# EAGLE schematic untitled (EAGLE 7.7.0)
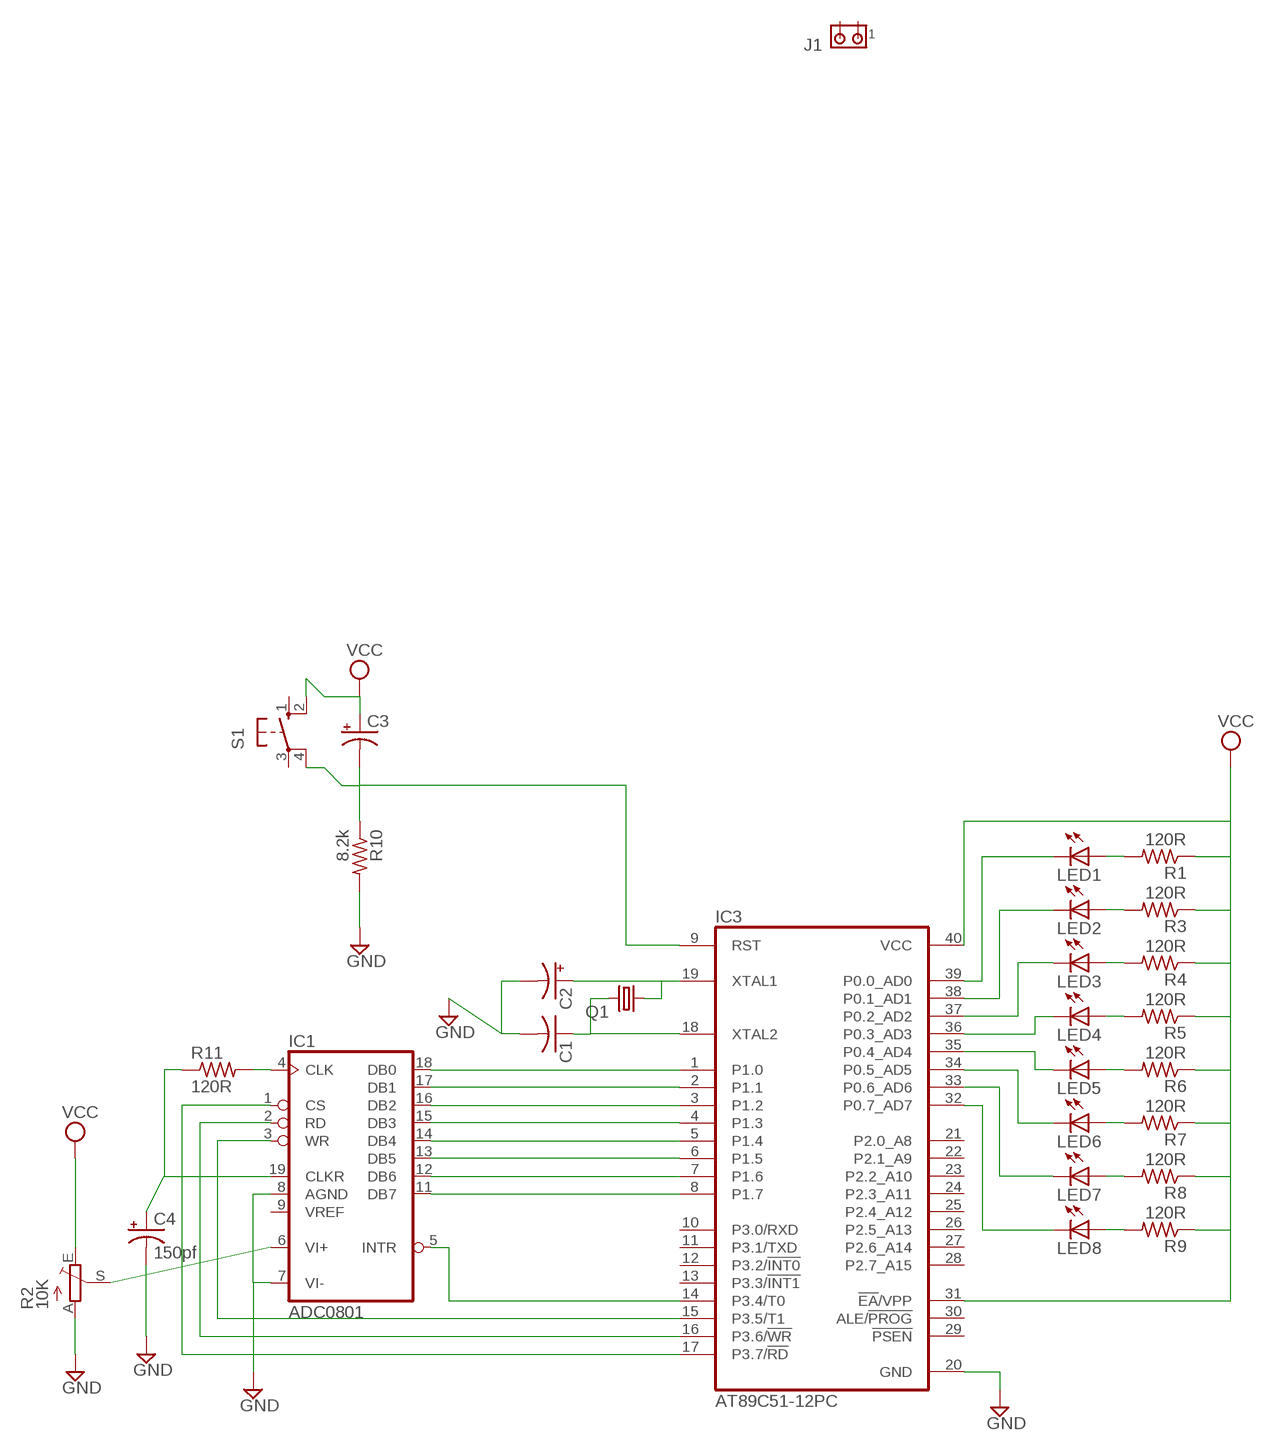
[diagram p0: schematic, sheet 1]

## Parts
C1  C-US025-025X050  [C025-025X050]
C2  CPOL-USE2.5-5V  [E2,5-4R]
C3  CPOL-USE2.5-5V  [E2,5-4R]
C4  150pf  CPOL-USE2.5-5V  [E2,5-4R]
IC1  ADC0801  [DIL20]
IC3  AT89C51-12PC  [DIL40]
J1  MTA02-100  [10X02MTA]
LED1  LEDCHIP-LED0805  [CHIP-LED0805]
LED2  LEDCHIP-LED0805  [CHIP-LED0805]
LED3  LEDCHIP-LED0805  [CHIP-LED0805]
LED4  LEDCHIP-LED0805  [CHIP-LED0805]
LED5  LEDCHIP-LED0805  [CHIP-LED0805]
LED6  LEDCHIP-LED0805  [CHIP-LED0805]
LED7  LEDCHIP-LED0805  [CHIP-LED0805]
LED8  LEDCHIP-LED0805  [CHIP-LED0805]
Q1  CRYSTALTC26H  [TC26H]
R1  120R  R-US_R2512  [R2512]
R2  10K  TRIM_EU-B25U  [B25U]
R3  120R  R-US_R2512  [R2512]
R4  120R  R-US_R2512  [R2512]
R5  120R  R-US_R2512  [R2512]
R6  120R  R-US_R2512  [R2512]
R7  120R  R-US_R2512  [R2512]
R8  120R  R-US_R2512  [R2512]
R9  120R  R-US_R2512  [R2512]
R10  8.2k  R-US_R2512  [R2512]
R11  120R  R-US_R2512  [R2512]
S1  10-XX  [B3F-10XX]

## Nets
GND: C1.2 C2.- C4.- IC1.7(VI-) IC1.8(AGND) IC3.20(GND) R2.A R10.2
N$1: IC3.39(P0.0_AD0) LED1.C
N$2: IC3.32(P0.7_AD7) LED8.C
N$3: IC3.33(P0.6_AD6) LED7.C
N$4: IC3.38(P0.1_AD1) LED2.C
N$5: IC3.37(P0.2_AD2) LED3.C
N$6: IC3.34(P0.5_AD5) LED6.C
N$7: IC3.35(P0.4_AD4) LED5.C
N$8: IC3.36(P0.3_AD3) LED4.C
N$9: LED8.A R9.2
N$10: LED7.A R8.2
N$11: LED6.A R7.2
N$12: LED5.A R6.2
N$13: LED4.A R5.2
N$14: LED3.A R4.2
N$15: LED2.A R3.2
N$16: LED1.A R1.2
N$17: C2.+ IC3.19(XTAL1) Q1.1
N$18: C1.1 IC3.18(XTAL2) Q1.2
N$20: IC1.12(DB6) IC3.7(P1.6)
N$21: C3.- IC3.9(RST) R10.1 S1.4(P1)
N$22: IC1.13(DB5) IC3.6(P1.5)
N$23: IC1.14(DB4) IC3.5(P1.4)
N$24: IC1.15(DB3) IC3.4(P1.3)
N$25: IC1.16(DB2) IC3.3(P1.2)
N$26: IC1.17(DB1) IC3.2(P1.1)
N$27: IC1.11(DB7) IC3.8(P1.7)
N$28: IC1.18(DB0) IC3.1(P1.0)
N$29: IC1.5(INTR) IC3.14(P3.4/T0)
N$30: IC1.3(WR) IC3.15(P3.5/T1)
N$31: IC1.2(RD) IC3.16(P3.6/!WR)
N$32: IC1.1(CS) IC3.17(P3.7/!RD)
N$33: IC1.4(CLK) R11.2
N$34: C4.+ IC1.19(CLKR) R11.1
N$35: IC1.6(VI+) R2.S
VCC: C3.+ IC3.31(!EA!/VPP) IC3.40(VCC) R1.1 R2.E R3.1 R4.1 R5.1 R6.1 R7.1 R8.1 R9.1 S1.2(S1)
Unconnected: IC1.9(VREF) IC3.10(P3.0/RXD) IC3.11(P3.1/TXD) IC3.12(P3.2/!INT0) IC3.13(P3.3/!INT1) IC3.21(P2.0_A8) IC3.22(P2.1_A9) IC3.23(P2.2_A10) IC3.24(P2.3_A11) IC3.25(P2.4_A12) IC3.26(P2.5_A13) IC3.27(P2.6_A14) IC3.28(P2.7_A15) IC3.29(!PSEN) IC3.30(ALE/!PROG) J1.1 J1.2 S1.1(S) S1.3(P)

## Power pins joined to a net without a drawn wire
GND: IC1.10(GND)
VCC: IC1.20(VCC)

## Library data of the parts
C1 = rcl:C-US: CAPACITOR, American symbol
C2-C4 = rcl:CPOL-US: POLARIZED CAPACITOR, American symbol
IC1 = linear:ADC0801: 8-bit A/D CONVERTER
IC3 = atmel:AT89C51-*: 8-bit Microcontroller with 4K Bytes Flash Not Recommended for New Designs. Use AT89S51. Source: http://www.atmel.com/dyn/resources/prod_documents/doc0265.; OC_FARNELL: unknown; OC_NEWARK: unknown
J1 = con-amp:MTA02-100: AMP connector
LED1-LED8 = led:LED: LED OSRAM: - CHIPLED LG R971, LG N971, LY N971, LG Q971, LY Q971, LO R971, LY R971 LH N974, LH R974 LS Q976, LO Q976, LY Q976 LO Q996 - Hyper CHIPLED LW Q18S LB Q993, LB Q99A, LB R99A - SideLED LS A670, LO A670, LY A670, LG A670, LP A670 LB A673, LV A673, LT A673, LW A673 LH A674 LY A675 LS A676, LA A676, LO A676, LY A676, LW A676 LS A679, LY A679, LG A679 - Hyper Micro SIDELED® LS Y876, LA Y876, LO Y876, LY Y876 LT Y87S - SmartLED LW L88C, LW L88S LB L89C, LB L89S, LG L890 LS L89K, LO L89K, LY L89K LS L896, LA L896, LO L896, LY L896 - TOPLED LS T670, LO T670, LY T670, LG T670, LP T670 LSG T670, LSP T670, LSY T670, LOP T670, LYG T670 LG T671, LOG T671, LSG T671 LB T673, LV T673, LT T673, LW T673 LH T674 LS T676, LA T676, LO T676, LY T676, LB T676, LH T676, LSB T676, LW T676 LB T67C, LV T67C, LT T67C, LS T67K, LO T67K, LY T67K, LW E67C LS E67B, LA E67B, LO E67B, LY E67B, LB E67C, LV E67C, LT E67C LW T67C LS T679, LY T679, LG T679 LS T770, LO T770, LY T770, LG T770, LP T770 LB T773, LV T773, LT T773, LW T773 LH T774 LS E675, LA E675, LY E675, LS T675 LS T776, LA T776, LO T776, LY T776, LB T776 LHGB T686 LT T68C, LB T68C - Hyper Mini TOPLED® LB M676 - Mini TOPLED Santana® LG M470 LS M47K, LO M47K, LY M47K Source: http://www.osram.convergy.de LUXEON: - LUMILED® LXK2-PW12-R00, LXK2-PW12-S00, LXK2-PW14-U00, LXK2-PW14-V00 LXK2-PM12-R00, LXK2-PM12-S00, LXK2-PM14-U00 LXK2-PE12-Q00, LXK2-PE12-R00, LXK2-PE12-S00, LXK2-PE14-T00, LXK2-PE14-U00 LXK2-PB12-K00, LXK2-PB12-L00, LXK2-PB12-M00, LXK2-PB14-N00, LXK2-PB14-P00, LXK2-PB14-Q00 LXK2-PR12-L00, LXK2-PR12-M00, LXK2-PR14-Q00, LXK2-PR14-R00 LXK2-PD12-Q00, LXK2-PD12-R00, LXK2-PD12-S00 LXK2-PH12-R00, LXK2-PH12-S00 LXK2-PL12-P00, LXK2-PL12-Q00, LXK2-PL12-R00 Source: www.luxeon.com KINGBRIGHT: KA-3528ASYC Source: www.kingbright.com
Q1 = crystal:CRYSTAL: CRYSTAL; OC_FARNELL: unknown; OC_NEWARK: unknown
R1 R3-R11 = rcl:R-US_: RESISTOR, American symbol
R2 = pot:TRIM_EU-: POTENTIOMETER
S1 = switch-omron:10-XX: OMRON SWITCH; MPN: B3F-1000; OC_FARNELL: 176432; OC_NEWARK: 36M3542